# Altium schematic sheet Block_Diagram.SchDoc
size A4; SheetNumber: 2; SheetTotal: 2
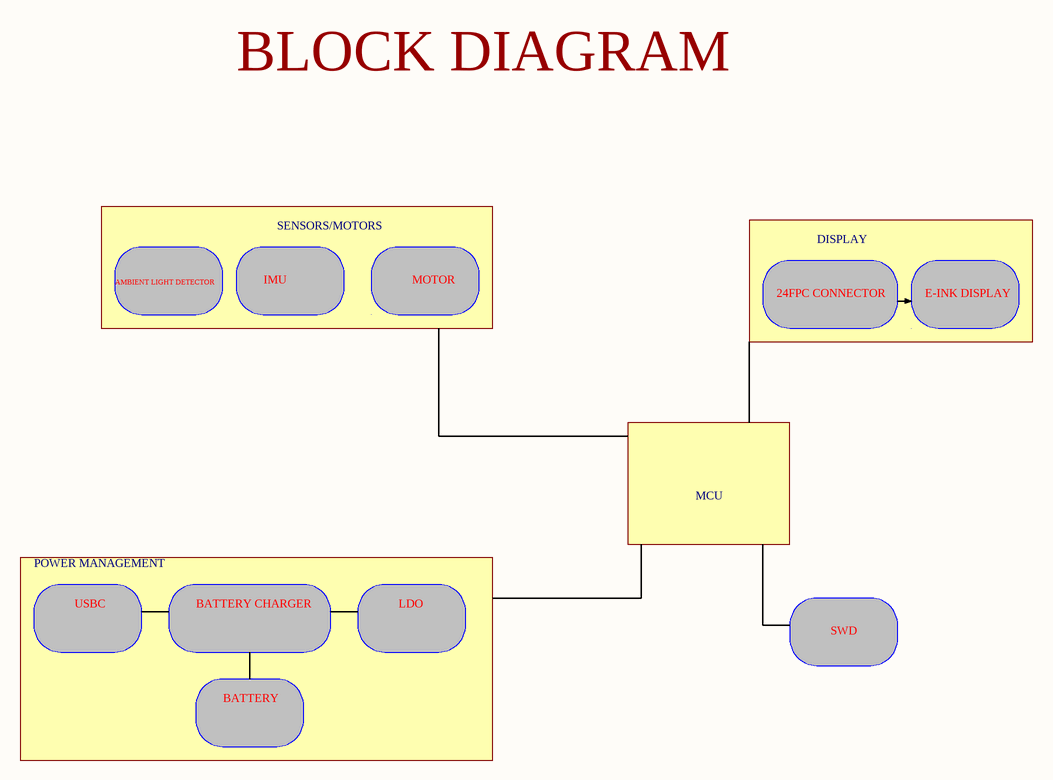
[diagram p0: Block_Diagram.SchDoc]

## Notes on the sheet
- BLOCK DIAGRAM
- SENSORS/MOTORS
- DISPLAY
- AMBIENT LIGHT DETECTOR
- IMU
- MOTOR
- 24FPC CONNECTOR
- E-INK DISPLAY
- MCU
- POWER MANAGEMENT
- USBC
- BATTERY CHARGER
- LDO
- SWD
- BATTERY